# EAGLE design CHARGE (EAGLE 9.4.0)
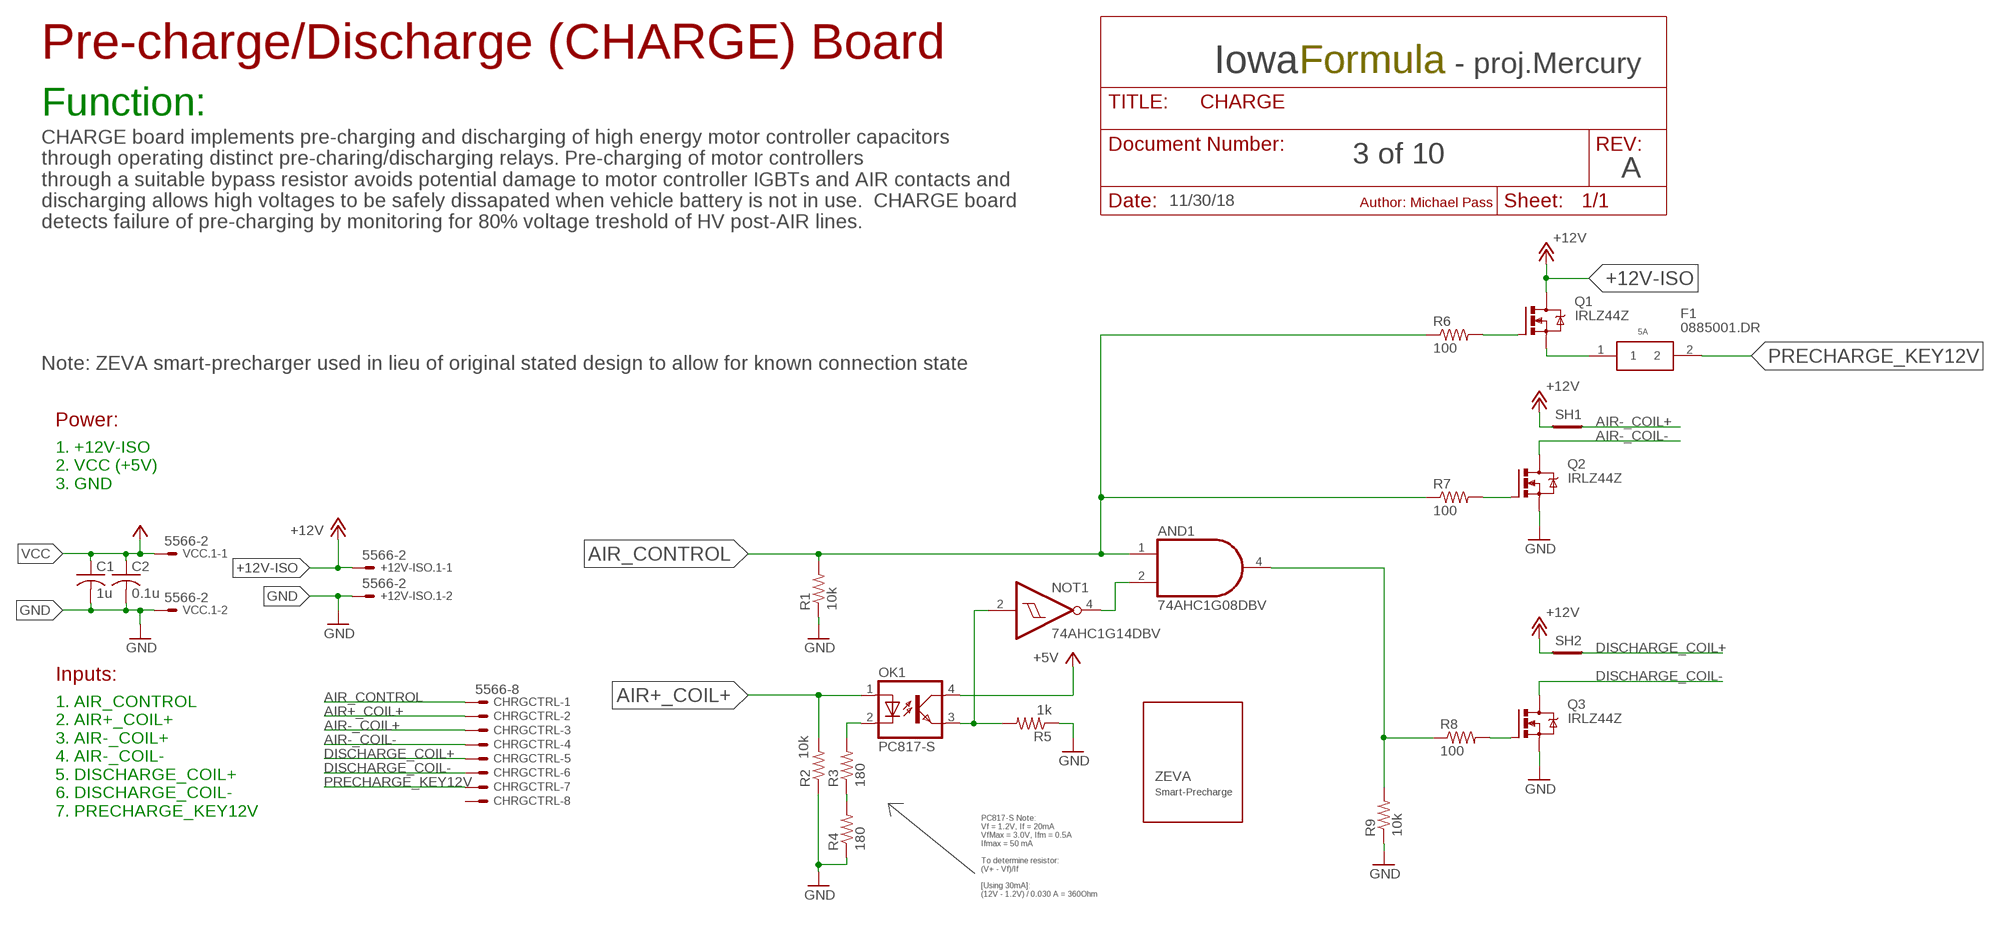
[diagram p0: schematic, sheet 1]

## Parts
+12V-ISO.1  5566-2  [5566-2]
AND1  74AHC1G08DBV  [SOT23-5]
C1  1u  C-USC0805  [C0805]
C2  0.1u  C-USC0805  [C0805]
CHRGCTRL  5566-8  [5566-8]
F1  0885001.DR  [FUSC10948X488N]
NOT1  74AHC1G14DBV  [SOT23-5]
OK1  PC817-S  [SOP04(2.54)]
Q1  IRLZ44Z  [TO220BH]
Q2  IRLZ44Z  [TO220BH]
Q3  IRLZ44Z  [TO220BH]
R1  10k  R-US_R0805  [R0805]
R2  10k  R-US_R0805  [R0805]
R3  180  R-US_R0805  [R0805]
R4  180  R-US_R0805  [R0805]
R5  1k  R-US_R0805  [R0805]
R6  100  R-US_R0805  [R0805]
R7  100  R-US_R0805  [R0805]
R8  100  R-US_R0805  [R0805]
R9  10k  R-US_R0805  [R0805]
SH1  SHORTA5  [SHORT_ALL-50]
SH2  SHORTA5  [SHORT_ALL-50]
U$1  ZEVA_SMART-PRECHARGE  [ZEVA]
VCC.1  5566-2  [5566-2]

## Nets
+12V-ISO: +12V-ISO.1.1 Q1.D SH1.1 SH2.1 ; supply symbol labelled +12V
AIR+_COIL+: CHRGCTRL.2 OK1.1(A) R2.2
AIR-_COIL+: CHRGCTRL.3 SH1.2
AIR-_COIL-: CHRGCTRL.4 Q2.D
AIR_CONTROL: AND1.1(I0) CHRGCTRL.1 R1.2 R6.1 R7.1
DISCHARGE_COIL+: CHRGCTRL.5 SH2.2
DISCHARGE_COIL-: CHRGCTRL.6 Q3.D
DISCHARGE_MOSFET: AND1.4(O) R8.1 R9.2
GND: +12V-ISO.1.2 C1.2 C2.2 Q2.S Q3.S R1.1 R2.1 R4.1 R5.1 R9.1 VCC.1.2
N$1: Q3.G R8.2
N$2: Q1.G R6.2
N$3: R3.1 R4.2
N$4: Q2.G R7.2
NO_PRECHRG: AND1.2(I1) NOT1.4(O)
OUTPUT77: NOT1.2(I) OK1.3(EMIT) R5.2
PRE-FUSE_PRECHARGE_KEY12V: F1.1 Q1.S
PRECHARGE_KEY12V: CHRGCTRL.7 F1.2
TAB11: OK1.2(C) R3.2
VCC: C1.1 C2.1 OK1.4(COL) VCC.1.1 ; supply symbol labelled +5V
Unconnected: CHRGCTRL.8

## Notes on the sheet
- Pre-charge/Discharge (CHARGE) Board
- Iowa | Formula | - proj.Mercury
- Function:
- 3 of 10
- A
- 11/30/18 | Author: Michael Pass
- CHARGE board implements pre-charging and discharging of high energy motor controller capacitors
  through operating distinct pre-charing/discharging relays. Pre-charging of motor controllers
  through a suitable bypass resistor avoids potential damage to motor controller IGBTs and AIR contacts and
  discharging allows high voltages to be safely dissapated when vehicle battery is not in use.  CHARGE board
  detects failure of pre-charging by monitoring for 80% voltage treshold of HV post-AIR lines.
- 5A
- Note: ZEVA smart-precharger used in lieu of original stated design to allow for known connection state
- Power:
- 1. +12V-ISO
  2. VCC (+5V)
  3. GND
- Inputs:
- 1. AIR_CONTROL
  2. AIR+_COIL+
  3. AIR-_COIL+
  4. AIR-_COIL-
  5. DISCHARGE_COIL+
  6. DISCHARGE_COIL-
  7. PRECHARGE_KEY12V
- PC817-S Note: 
  Vf = 1.2V, If = 20mA
  VfMax = 3.0V, Ifm = 0.5A
  Ifmax = 50 mA
  
  To determine resistor:
  (V+ - Vf)/If
  
  [Using 30mA]:
  (12V - 1.2V) / 0.030 A = 360Ohm

## Power pins joined to a net without a drawn wire
GND: AND1.3(GND) NOT1.3(GND)
VCC: AND1.5(VCC) NOT1.5(VCC)

## Library data of the parts
+12V-ISO.1 VCC.1 = con-molex:5566-2: Mini FIT connector 2 pol Source: http://www.molex.com; MF: MOLEX; OC_FARNELL: 1822072; OC_NEWARK: unknown
AND1 = 74xx-little-us:74*1G08: 2-input AND gate
C1 C2 = rcl:C-US: CAPACITOR, American symbol; SPICEPREFIX: C
CHRGCTRL = con-molex:5566-8: Mini FIT connector 8 pol Source: http://www.molex.com; MF: MOLEX; OC_FARNELL: unknown; OC_NEWARK: unknown
F1 = 0885001.DR:0885001.DR: LITTELFUSE - 0885001.DR - FUSE, AEC-Q200, 1A, 500VDC, 0402 Source: Datasheet <https://m.littelfuse.com/~/media/electronics/datasheets/fuses/littelfuse_fuse_885_datasheet.pdf.pdf>; DESCRIPTION: LITTELFUSE - 0885001.DR - FUSE, AEC-Q200, 1A, 500VDC, 0402; HEIGHT: 4.88mm; MANUFACTURER_NAME: LITTELFUSE; MANUFACTURER_PART_NUMBER: 0885001.DR; MOUSER_PART_NUMBER: 576-0885001.DR; MOUSER_PRICE-STOCK: https://www.mouser.com/Search/Refine.aspx?Keyword=576-0885001.DR
NOT1 = 74xx-little-us:74*1G14: Single Schmitt-Trigger Inverter Gate
OK1 = IowaFormula:PC817-S: SHARP OPTO COUPLER
Q1-Q3 = transistor-power:IRLZ44Z: N-Channel HEXFET® Power MOSFET Logic Level AUTOMOTIVE MOSFET Source: http://www.irf.com/product-info/datasheets/data/irlz44zpbf.pdf
R1-R9 = rcl:R-US_: RESISTOR, American symbol; SPICEPREFIX: R
SH1 SH2 = shorts:SHORT: Short between two nets; BOM: no
U$1 = IowaFormula:ZEVA_SMART-PRECHARGE

## Board
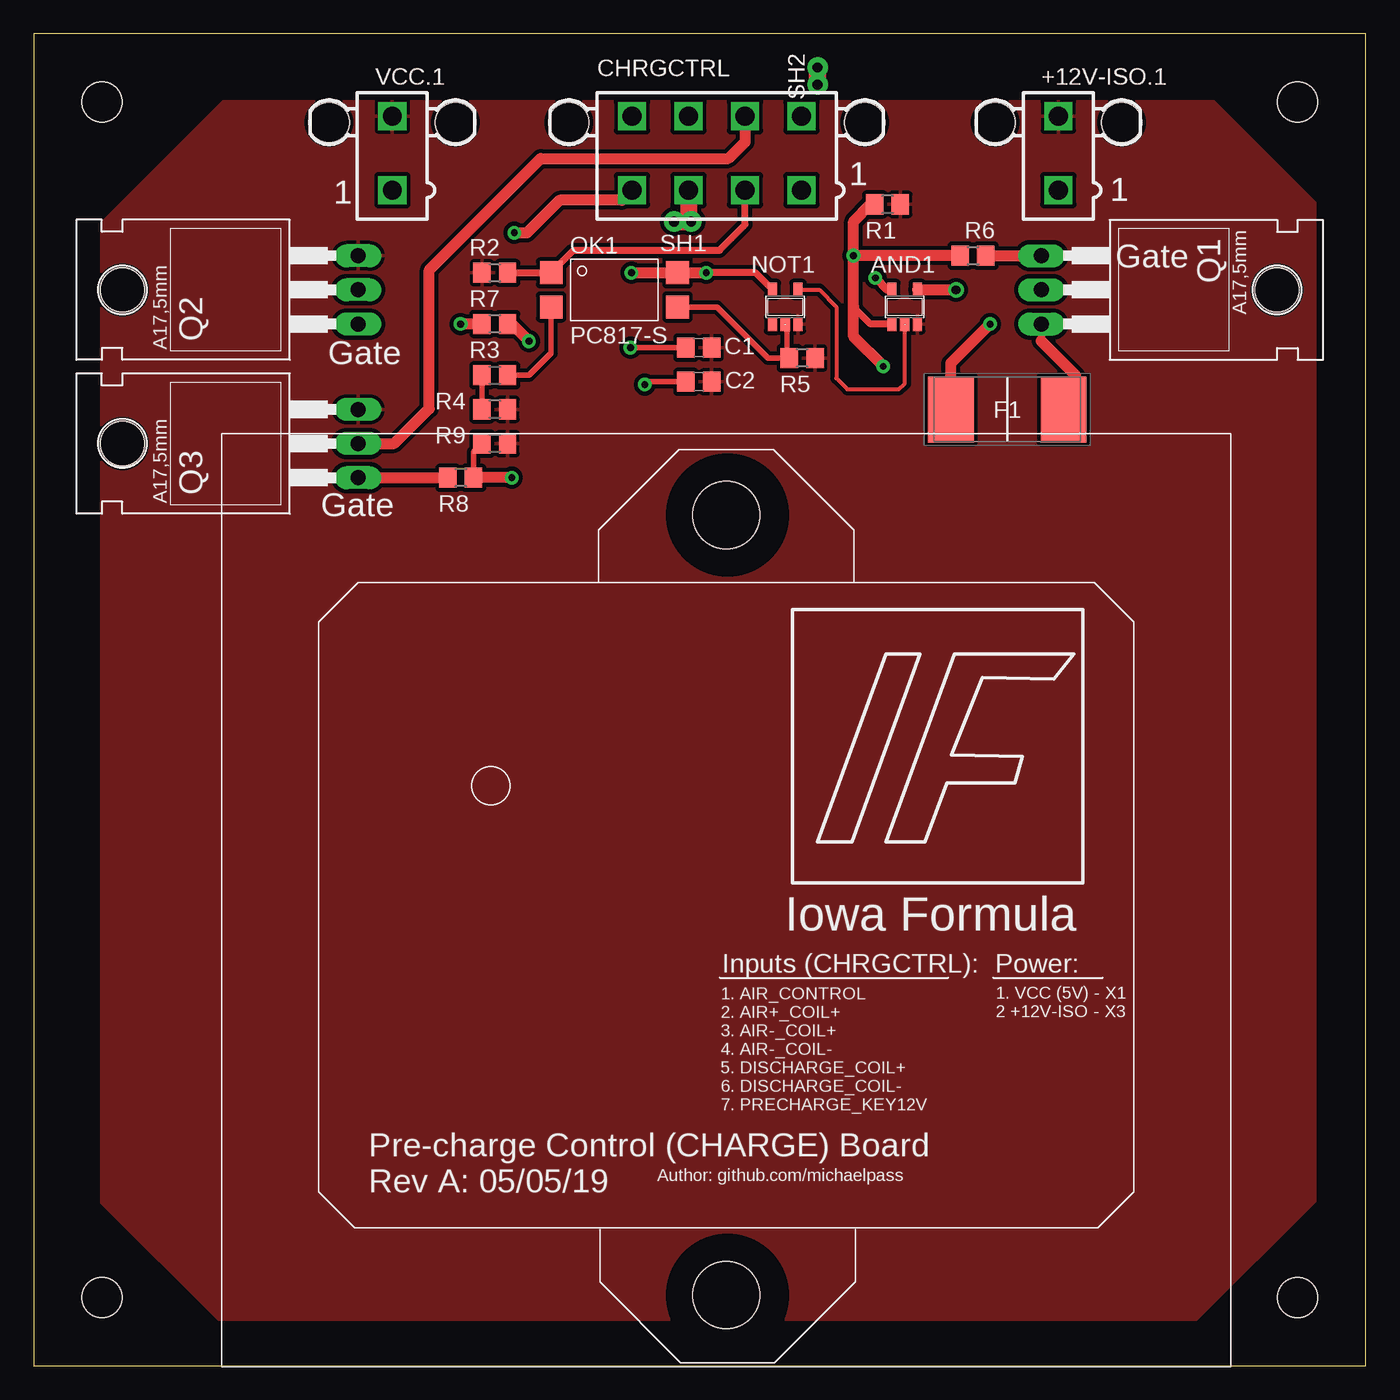
[diagram p1: board, top side]
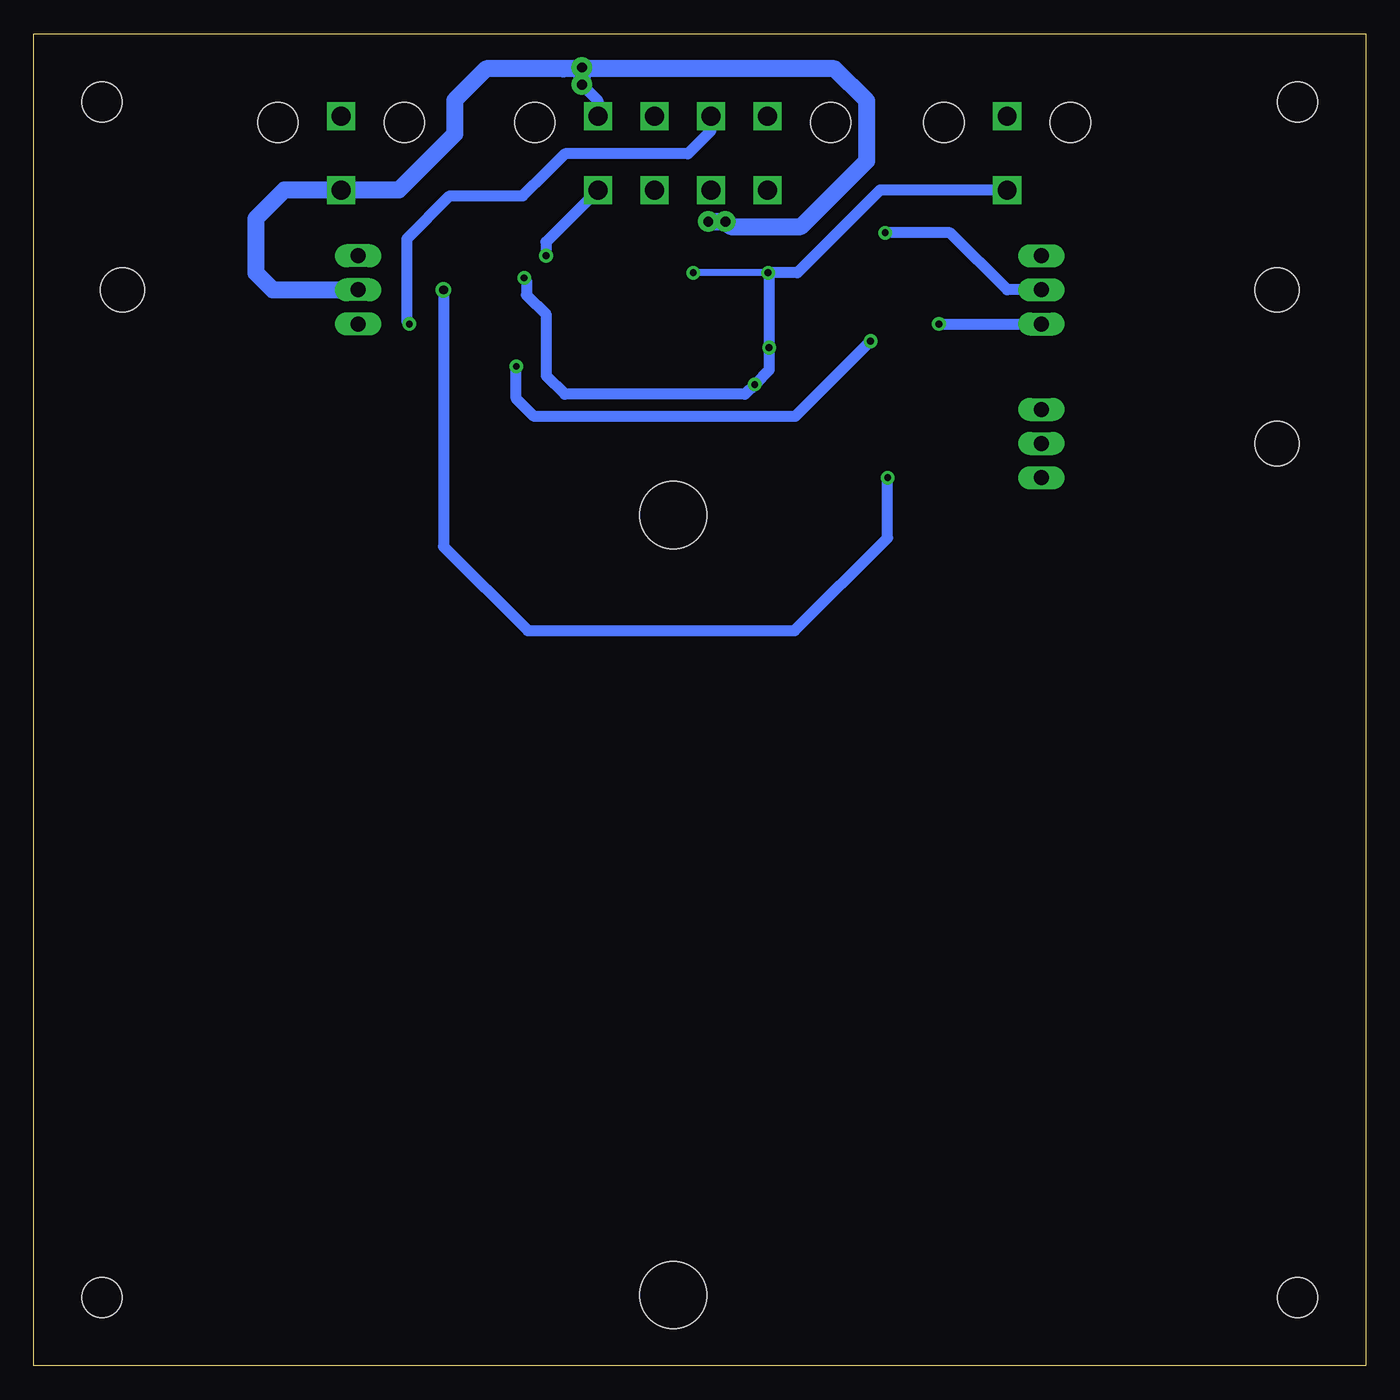
[diagram p2: board, bottom side, seen from below]

Size 99.06 x 99.06 mm. Coordinates in mm from the lower left corner, seen from the top.
Outline: 0,0 99.06,0 99.06,99.06 0,99.06 0,0
Copper layers (1*16): Top 0.035mm / dielectric 1.5mm / Bottom 0.035mm
Design rules "default *": minimum track width 8mil, minimum drill 20mil, track to track 8mil, track to pad 8mil, pad to pad 8mil, via to via 8mil, smd to smd 8mil, copper to edge 10mil, drill to drill 8mil, minimum pad ring 12mil, minimum via ring 10mil, stop-mask expansion 4mil, vias tented up to drill 25mil, thermal gap 10mil
Holes 3 mm at 93.98,93.98 5.08,93.98 5.08,5.08 93.98,5.08

### Footprints (pad centres in the part's own frame; a part is rotated, then mirrored left to right if it is on the bottom)
5566-2 = drill 1.4 square: 1 0,-2.75; 2 0,2.75 | hole 3: 4.7,2.29; -4.7,2.29
SOT23-5 = smd 0.69 x 0.99: 1 -0.95,-1.29; 2 0,-1.29; 3 0.95,-1.29; 4 0.95,1.3; 5 -0.95,1.3
C0805 = smd 1.3 x 1.5: 1 -0.95,0; 2 0.95,0
5566-8 = drill 1.4 square: 1 6.3,-2.75; 2 2.1,-2.75; 3 -2.1,-2.75; 4 -6.3,-2.75; 5 6.3,2.75; 6 2.1,2.75; 7 -2.1,2.75; 8 -6.3,2.75 | hole 3: 11,2.29; -11,2.29
FUSC10948X488N = smd 3.41 x 4.91: 1 -4.195,0; 2 4.195,0
SOP04(2.54) = smd 1.68 x 1.71: 1 -4.692,1.27; 2 -4.692,-1.27; 3 4.692,-1.27; 4 4.692,1.27
TO220BH = drill 1.118 long: D 0,-6.35; G -2.54,-6.35; S 2.54,-6.35 | hole 3.302: 0,11.176
R0805 = smd 1.3 x 1.5: 1 -0.95,0; 2 0.95,0
SHORT_ALL-50 = drill 0.737 pad 1.524: 1 -0.635,0; 2 0.635,0
ZEVA = hole 5: 37.529,63.26; 37.529,5.26

### Placement (x,y rotation side)
+12V-ISO.1  76.2,90.17 0 top
AND1  64.77,78.74 0 top
C1  49.45,75.72 0 top
C2  49.45,73.18 0 top
CHRGCTRL  50.8,90.17 0 top
F1  72.39,71.12 180 top
NOT1  55.88,78.74 0 top
OK1  43.18,80.01 0 top
Q1  81.28,80.01 270 top
Q2  17.78,80.01 90 top
Q3  17.78,68.58 90 top
R1  63.5,86.36 180 top
R2  34.29,81.28 0 top
R3  34.29,73.66 0 top
R4  34.29,71.12 180 top
R5  57.15,74.93 180 top
R6  69.85,82.55 0 top
R7  34.29,77.47 180 top
R8  31.75,66.04 180 top
R9  34.29,68.58 180 top
SH1  48.26,85.09 0 top
SH2  58.29,95.91 270 top
U$1  13.97,0 0 top
VCC.1  26.67,90.17 0 top

### Tracks (layer width: path | path; a pad name or v marks a point on that pad's centre or on a via)
+12V-ISO
  Bottom 0.813: 58.37,96.32 58.5,96.44 | 58.37,96.32 58.24,96.44 58.24,96.49 SH2.1 | 58.37,96.32 | 58.5,96.44 58.37,96.32 | 58.37,96.32 | 59.69,96.44 58.5,96.44
  Bottom 1.27: Q1.D 81.28,80.01 82.55,81.28 82.55,85.29 80.42,87.42 +12V-ISO.1.1 71.91,87.42 67.74,91.59 67.74,94.11 65.41,96.44 59.69,96.44 58.5,96.44 | SH1.1 47.24,84.71 42.01,84.71 37.11,89.61 37.11,94.06 39.5,96.44 58.24,96.44
AIR+_COIL+
  Top 0.508: CHRGCTRL.2 52.91,84.86 51,82.96 40.16,82.96 OK1.1 R2.2
AIR-_COIL+
  Top 1.27: SH1.2 48.7,85.28 CHRGCTRL.3
AIR-_COIL-  (via drill 0.51)
  Top 0.813: v35.74,84.25 36.68,84.25 39.09,86.67 43.74,86.67 CHRGCTRL.4
  Bottom 0.813: Q2.D 26.67,80.01 30.91,84.25 v35.74,84.25
AIR_CONTROL  (via drill 0.51)
  Top 0.508: AND1.1 63.8,77.47 62.23,77.47 60.96,78.74 | 62.23,86.36 R1.2
  Top 0.813: v60.96,82.55 60.96,78.74 60.96,76.53 v63.17,74.32 | v60.96,82.55 60.96,85.09 62.23,86.36 | R6.1 v60.96,82.55 | R7.1 35.56,77.47 v36.83,76.2
  Bottom 0.813: CHRGCTRL.1 60.96,83.56 v60.96,82.55 | v36.83,76.2 42.44,70.59 61.85,70.59 63.17,71.91 v63.17,74.32
DISCHARGE_COIL+
  Bottom 0.813: SH2.2 57.1,94.08 CHRGCTRL.5
DISCHARGE_COIL-
  Top 0.813: Q3.D 26.82,68.58 29.41,71.17 29.41,81.48 37.69,89.76 51.66,89.76 52.9,91 CHRGCTRL.6
DISCHARGE_MOSFET  (via drill 0.51, 0.65)
  Top 0.406: R9.2 32.7,67.94 R8.1
  Top 0.813: AND1.4 65.75,80.01 v68.58,80.01 | v35.56,66.04 R8.1
  Bottom 0.813: v68.58,80.01 68.58,60.94 62.31,54.66 42.47,54.66 35.56,61.57 v35.56,66.04
GND
  pour Top (isolate 0.305): 14.1,93.98 87.76,93.98 95.25,86.49 95.25,12.24 86.46,3.45 13.77,3.45 5.08,12.14 5.08,84.96
N$1
  Top 0.813: Q3.G R8.2
N$2
  Top 0.813: R6.2 Q1.G
N$3
  Top 0.406: R3.1 R4.2
N$4  (via drill 0.51)
  Top 0.813: R7.2 v31.75,77.47
  Bottom 0.813: v31.75,77.47 Q2.G
NO_PRECHRG
  Top 0.305: 56.86,80.01 58.42,80.01 59.69,78.74 59.69,73.43 60.5,72.62 64.34,72.62 64.77,73.05 AND1.2
  Top 0.406: NOT1.4 56.86,80.01
OUTPUT77
  Top 0.406: NOT1.2 56.03,77.3 56.03,75.1 R5.2 54.61,74.93 50.8,78.74 OK1.3
PRE-FUSE_PRECHARGE_KEY12V
  Top 0.508: Q1.S 74.93,76.2 | 77.47,73.66 77.47,72 F1.1
  Top 0.813: 74.93,76.2 77.47,73.66
PRECHARGE_KEY12V  (via drill 0.51)
  Top 0.813: F1.2 68.19,74.55 v71.12,77.47
  Bottom 0.813: v71.12,77.47 71.32,77.67 71.32,83.8 68.12,87 62.69,87 60.87,88.81 | 60.87,88.81 | CHRGCTRL.7 48.7,91.84 50.42,90.12 59.56,90.12 60.87,88.81
TAB11
  Top 0.406: R3.2 36.83,73.66 38.49,75.32 OK1.2
VCC  (via drill 0.51)
  Top 0.406: v44.37,75.72 C1.1 | v45.44,72.97 45.64,73.18 C2.1
  Top 0.508: NOT1.5 53.69,81.28 v50.01,81.28
  Top 0.61: v62.59,80.9 63.45,80.04 AND1.5
  Top 0.813: v44.45,81.28 OK1.4 v50.01,81.28
  Bottom 0.508: v44.45,81.28 v50.01,81.28
  Bottom 0.61: v44.45,81.28 44.37,81.2 | 62.41,80.72 v62.59,80.9
  Bottom 0.813: VCC.1.1 36.13,87.42 42.27,81.28 v44.45,81.28 | 44.37,81.2 v44.37,75.72 44.37,74.04 v45.44,72.97 46.18,72.24 59.56,72.24 60.94,73.61 60.94,78.16 62.41,79.63 62.41,80.72

### Text on the board
tNames: 1 | 1 | 1 | Gate | Gate | Gate | Iowa Formula | Inputs (CHRGCTRL): | Power: | 1. VCC (5V) - X1 / 2 +12V-ISO - X3 | 1. AIR_CONTROL / 2. AIR+_COIL+ / 3. AIR-_COIL+ / 4. AIR-_COIL- / 5. DISCHARGE_COIL+ / 6. DISCHARGE_COIL- / 7. PRECHARGE_KEY12V | Author: github.com/michaelpass | Pre-charge Control (CHARGE) Board / Rev A: 05/05/19